# EAGLE schematic Печатная плата принимающая ось X (EAGLE 9.0.0)
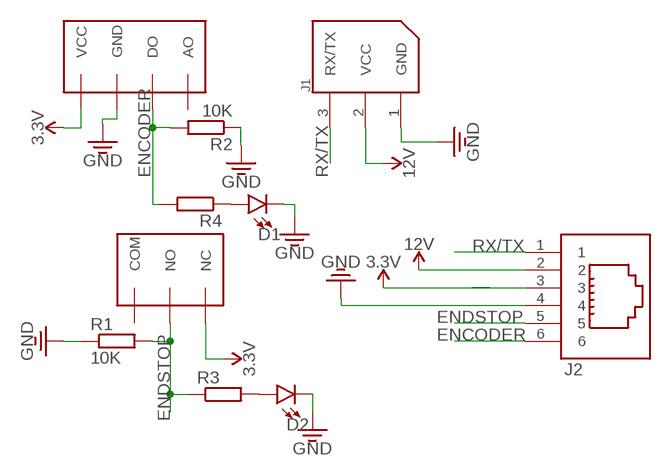
[diagram p0: schematic, sheet 1]

## Parts
D1  LED5MM  [LED_5MM]
D2  LED5MM  [LED_5MM]
J1  22-03-5035  [5267-3]
J2  615006138421  [615006138421]
R1  10K  R-EU_0204/7  [0204/7]
R2  10K  R-EU_0204/7  [0204/7]
R3  R-EU_0204/7  [0204/7]
R4  R-EU_0204/7  [0204/7]
U$1  OPTICAL_ENCODER_FC-01  [OPTICAL_ENCODER_FC-01]
U$2  ENDSTOP  [ENDSTOP]

## Nets
3.3V: J2.3 U$1.VCC U$2.NC
12V: J1.2(VCC) J2.2
ENCODER: J2.6 R2.2 R4.2 U$1.DO
ENDSTOP: J2.5 R1.2 R3.1 U$2.NO
GND: D1.K(C) D2.K(C) J1.1(GND) J2.4 R1.1 R2.1 U$1.GND
N$1: D2.A R3.2
N$2: D1.A R4.1
RX/TX: J1.3(RX/TX) J2.1
Unconnected: U$1.AO U$2.COM

## Library data of the parts
D1 D2 = SparkFun-LED:LED: LED (Generic) Standard schematic elements and footprints for 5mm, 3mm, 1206, and 0603 sized LEDs. Generic LEDs with no color specified.
J1 = molex:22-03-5035: Molex SPOX Vert, Tin (Dynamixel AX/MX Bus) tested: YES (arbotix)
J2 = Wurth_Elektronik_Electromechanic_Input-Output_Connectors_rev16a:615006138421: WR-MJ Horizontal Plastic 6P6C Modular Jack Tab Up, 6 Pins=>Code : Con_I-O_MJ-H_Plastic_Up_615006138421 <http://katalog.we-online.de/media/images/eican/Con_I-O_MJ-H_Plastic_Up_6150xx138421_pf2.jpg> Details see: http://katalog.we-online.de/en/em/615_0xx_138_121 Created 2014-07-10, Karrer Zheng 2014 (C) Würth Elektronik
R1-R4 = resistor:R-EU_: RESISTOR, European symbol
U$1 = other components:OPTICAL_ENCODER_FC-01
U$2 = other components:ENDSTOP